# Altium project Pedal_PRJ.PrjPCB
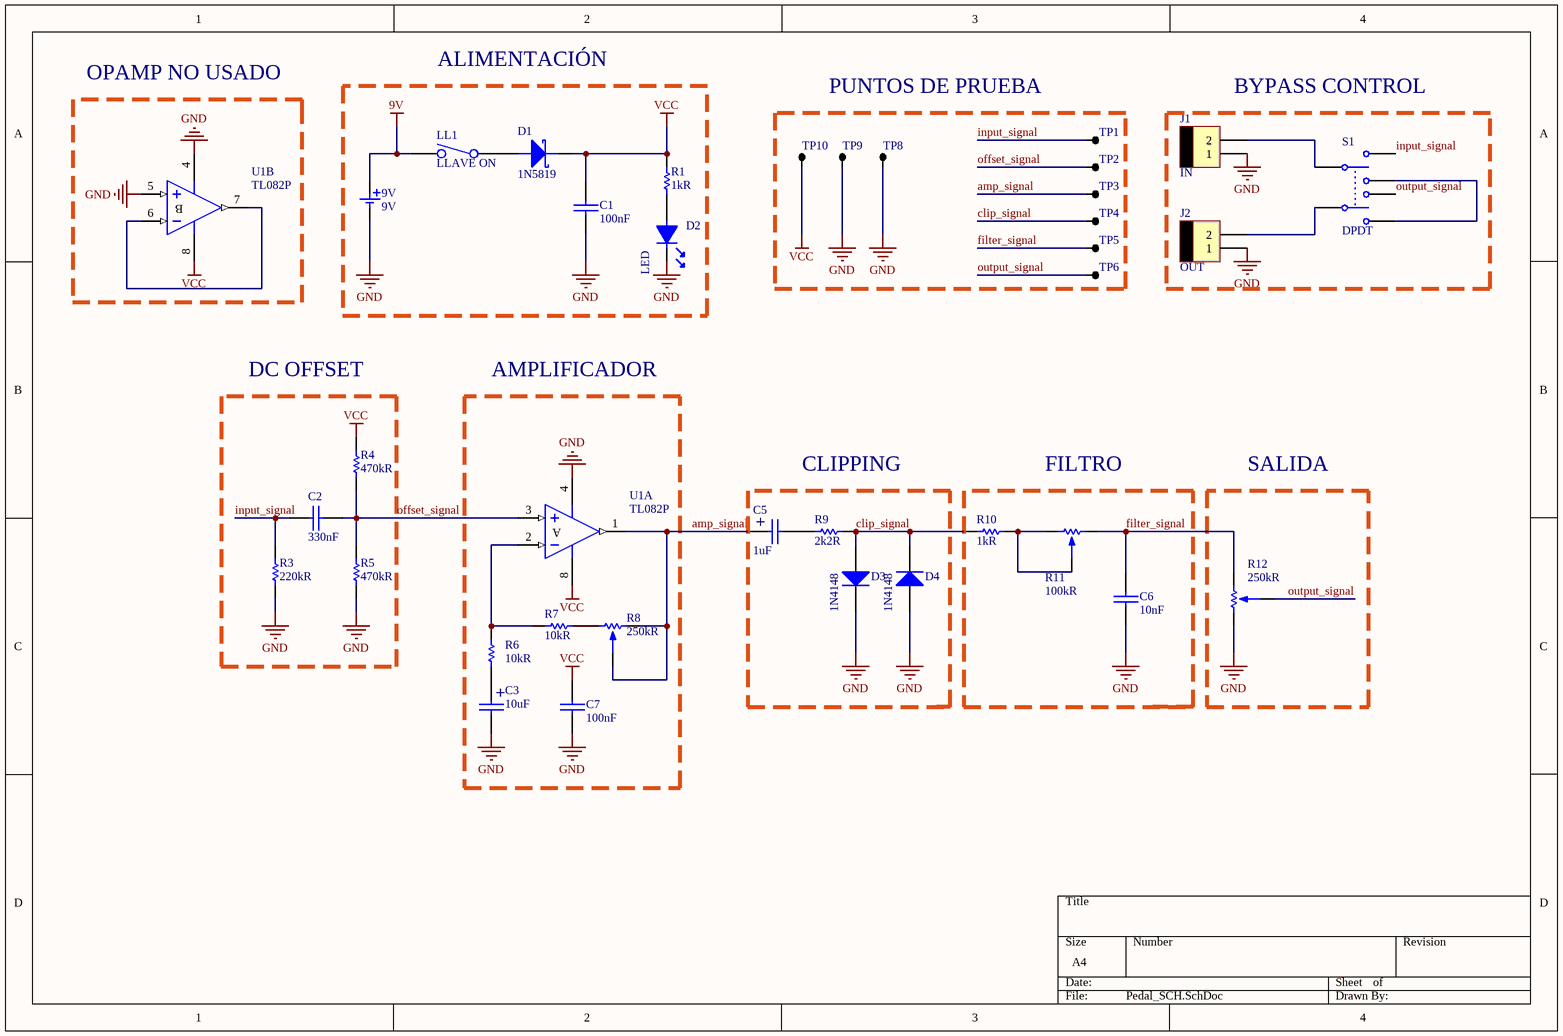
[diagram p0: Pedal_SCH.SchDoc]
1 sheet, 36 parts. Net scope: global (net labels, ports and power ports of the same name join across sheets).
Board file: Pedal_PCB.PcbDoc

## Sheet Pedal_SCH.SchDoc
size A4

### Parts
9V  9V  [MOLEX2]
C1  100nF  [0805]
C2  330nF  [CAP_FILM]
C3  10uF  [CAP100RP]
C5  1uF  [CAP100RP]
C6  10nF  [CAP_FILM_POLY]
C7  100nF  [0805]
D1  1N5819  [DO-41]
D2  LED  [MOLEX2]
D3  1N4148  [DO-35]
D4  1N4148  [DO-35]
J1  IN  [MOLEX2]
J2  OUT  [MOLEX2]
LL1  LLAVE ON  [MOLEX2]
R1  1kR  [0805]
R3  220kR  [0805]
R4  470kR  [0805]
R5  470kR  [0805]
R6  10kR  [0805]
R7  10kR  [0805]
R8  250kR  [MOLEX3]
R9  2k2R  [0805]
R10  1kR  [0805]
R11  100kR  [MOLEX3]
R12  250kR  [MOLEX3]
S1  DPDT  [MOLEX6]
TP1  IN  [TPTH]  (value not drawn)
TP2  OFF  [TPTH]  (value not drawn)
TP3  AMP  [TPTH]  (value not drawn)
TP4  CLI  [TPTH]  (value not drawn)
TP5  FIL  [TPTH]  (value not drawn)
TP6  OUT  [TPTH]  (value not drawn)
TP8  GND  [TPTH]  (value not drawn)
TP9  GND  [TPTH]  (value not drawn)
TP10  VCC  [TPTH]  (value not drawn)
U1  TL082P  [P008]  (parts A,B of 2)

### Blocks framed on the sheet
ALIMENTACIÓN: 9V C1 D1 D2 LL1 R1
OPAMP NO USADO: U1
PUNTOS DE PRUEBA: TP1-TP6 TP8-TP10
BYPASS CONTROL: J1 J2 S1
DC OFFSET: C2 R3-R5
AMPLIFICADOR: C3 C7 R6-R8 U1
SALIDA: R12

### Nets
9V: 9V.1 LL1.2
GND: 9V.2 C1.2 C3.2 C6.2 C7.1 D2.2 D3.2(K) D4.1(A) J1.1 J2.1 R3.2 R5.2 R12.2 TP8.1 TP9.1 U1.4(V-) U1.5(IN+)
VCC: C1.1 C7.2 D1.K R1.1 R4.2 TP10.1 U1.8(V+)
amp_signal: C5.1 R8.1 R8.2 TP3.1 U1.1(OUT)
clip_signal: D3.1(A) D4.2(K) R9.2 R10.2 TP4.1
filter_signal: C6.1 R11.1 R12.1 TP5.1
input_signal: C2.1 R3.1 S1.5 TP1.1
offset_signal: C2.2 R4.1 R5.1 TP2.1 U1.3(IN+)
output_signal: R12.3 S1.2 TP6.1
NetC3_1: C3.1 R6.2
NetC5_2: C5.2 R9.1
NetD1_A: D1.A LL1.1
NetD2_1: D2.1 R1.2
NetJ1_2: J1.2 S1.6
NetJ2_2: J2.2 S1.1
NetR6_1: R6.1 R7.2 U1.2(IN-)
NetR7_1: R7.1 R8.3
NetR10_1: R10.1 R11.2 R11.3
NetS1_3: S1.3 S1.4
NetU1_6: U1.6(IN-) U1.7(OUT)

### Notes on the sheet
- CLIPPING
- FILTRO
- (in symbol CAPPOL) +
- (in symbol TL082P, part A) A
- (in symbol TL082P, part B) B

### Library data of the parts
9V = BATERIA: Value: MOLEX2; Footprint: *
C1 C2 C6 = CAP: Footprint: *
  C1: Value: 100nF
  C2: Value: 330nF
  C6: Value: 10nF
C3 C5 = CAPPOL: Footprint: *
  C3: Value: 10uF
  C5: Value: 1uF
C7 = CAP: Value: 330nF; Footprint: *
D1 = DIODE SCHOTTKY: Footprint: *
D2 = LED: Value: Led Verde 5mm; Footprint: *
D3 D4 = Diode 1N4148: High Conductance Fast Diode; Footprint: *; Value: 1N4148
J1 = MOLEX2: INPUT; Value: MOLEX2; Footprint: *
J2 = MOLEX2: Value: MOLEX2; Footprint: *
R1 R3-R7 R9 R10 = RES: Footprint: *
  R1 R10: Value: 1kR
  R3: Value: 220kR
  R4 R5: Value: 470kR
  R6 R7: Value: 10kR
  R9: Value: 2k2R
R8 R11 R12 = POTENCIOMETRO: Footprint: *
  R8 R12: Value: 250kR
  R11: Value: 100kR
S1 = SW-DPDT: Double-Pole, Double-Throw Switch; Published: 24-Mar-1999; LatestRevisionDate: 17-Jul-2002; LatestRevisionNote: Re-released for DXP Platform.; PackageReference: DPDT-6; Publisher: Altium Limited; PackageDescription: Switch; 6 Leads
TP1-TP6 TP8-TP10 = TP
U1 = TL082P: JFET-Input Operational Amplifier; Published: 16-Jan-2001; LatestRevisionDate: 04-Mar-2005; LatestRevisionNote: Stylized 3D Model Added.; DatasheetVersion: Feb-1999; PackageVersion: Jun-1999; PackageReference: P008; Publisher: Altium Limited; PackageDescription: DIP; 8 Leads; Row Spacing 7.62 mm; Pitch 2.54 mm; Code_JEDEC: MO-001-AN; ComponentLink1Description: Manufacturer Link; ComponentLink1URL: http://www.ti.com/; ComponentLink2Description: Datasheet; ComponentLink2URL: http://www-s.ti.com/sc/ds/tl082.pdf
LL1 = LLAVE ON: Value: *; Footprint: *